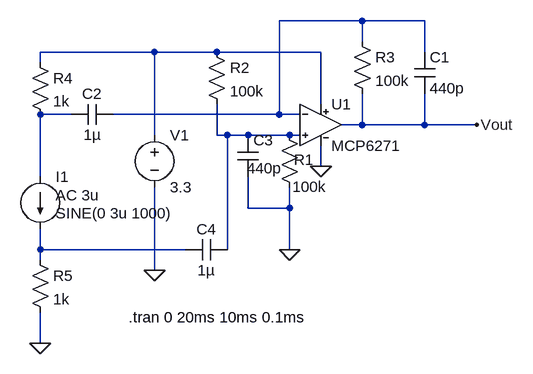
[diagram p0: schematic Audio_AmpV3.asc]
Audio_AmpV3.asc, the LTspice schematic file:
Version 4
SHEET 1 880 680
WIRE 240 0 112 0
WIRE 336 0 240 0
WIRE 240 32 240 0
WIRE -80 48 -256 48
WIRE 16 48 -80 48
WIRE 176 48 16 48
WIRE 336 48 336 0
WIRE -256 64 -256 48
WIRE 176 128 176 48
WIRE -208 144 -256 144
WIRE 112 144 112 0
WIRE 112 144 -144 144
WIRE 144 144 112 144
WIRE 240 160 240 112
WIRE 240 160 208 160
WIRE 336 160 336 112
WIRE 336 160 240 160
WIRE 416 160 336 160
WIRE -80 176 -80 48
WIRE 16 176 16 128
WIRE 32 176 16 176
WIRE 64 176 32 176
WIRE 128 176 64 176
WIRE 144 176 128 176
WIRE 176 224 176 192
WIRE -256 240 -256 144
WIRE 64 288 64 240
WIRE 128 288 128 256
WIRE 128 288 64 288
WIRE -256 352 -256 320
WIRE -32 352 -256 352
WIRE 32 352 32 176
WIRE 128 352 128 288
WIRE -256 368 -256 352
WIRE -80 384 -80 256
WIRE -256 496 -256 448
FLAG 176 224 0
FLAG -80 384 0
FLAG 416 160 Vout
FLAG -256 496 0
FLAG 128 352 0
SYMBOL MCP6271 176 160 R0
SYMATTR InstName U1
SYMBOL voltage -80 160 R0
WINDOW 123 0 0 Left 2
WINDOW 39 0 0 Left 2
SYMATTR InstName V1
SYMATTR Value 3.3
SYMBOL res 0 32 R0
SYMATTR InstName R2
SYMATTR Value 100k
SYMBOL res 224 16 R0
SYMATTR InstName R3
SYMATTR Value 100k
SYMBOL cap 320 48 R0
SYMATTR InstName C1
SYMATTR Value 440p
SYMBOL current -256 240 R0
WINDOW 123 24 28 Left 2
WINDOW 39 0 0 Left 2
WINDOW 3 24 56 Left 2
SYMATTR Value2 AC 3u
SYMATTR Value SINE(0 3u 1000)
SYMATTR InstName I1
SYMBOL cap -144 128 R90
WINDOW 0 0 32 VBottom 2
WINDOW 3 32 32 VTop 2
SYMATTR InstName C2
SYMATTR Value 1µ
SYMBOL res -272 48 R0
SYMATTR InstName R4
SYMATTR Value 1k
SYMBOL res -272 352 R0
SYMATTR InstName R5
SYMATTR Value 1k
SYMBOL cap 32 336 R90
WINDOW 0 0 32 VBottom 2
WINDOW 3 32 32 VTop 2
SYMATTR InstName C4
SYMATTR Value 1µ
SYMBOL cap 48 176 R0
WINDOW 3 14 51 Left 2
SYMATTR InstName C3
SYMATTR Value 440p
SYMBOL res 112 160 R0
WINDOW 0 23 54 Left 2
WINDOW 3 20 95 Left 2
SYMATTR InstName R1
SYMATTR Value 100k
TEXT -120 456 Left 2 !.tran 0 20ms 10ms 0.1ms

The netlist it stands for:
* Audio_AmpV3.asc
XU1 N004 N001 N002 0 Vout MCP6271  ; pins IN+ IN- VDD GND Vout
V1 N002 0 3.3
R2 N002 N004 100k
R3 N001 Vout 100k
C1 N001 Vout 440p
I1 N003 N005 SINE(0 3u 1000) AC 3u
C2 N001 N003 1µ
R4 N002 N003 1k
R5 N005 0 1k
C4 N004 N005 1µ
C3 N004 0 440p
R1 N004 0 100k
.tran 0 20ms 10ms 0.1ms
.lib MCP6271.MOD
.backanno
.end